# EAGLE design untitled (EAGLE 9.6.2)
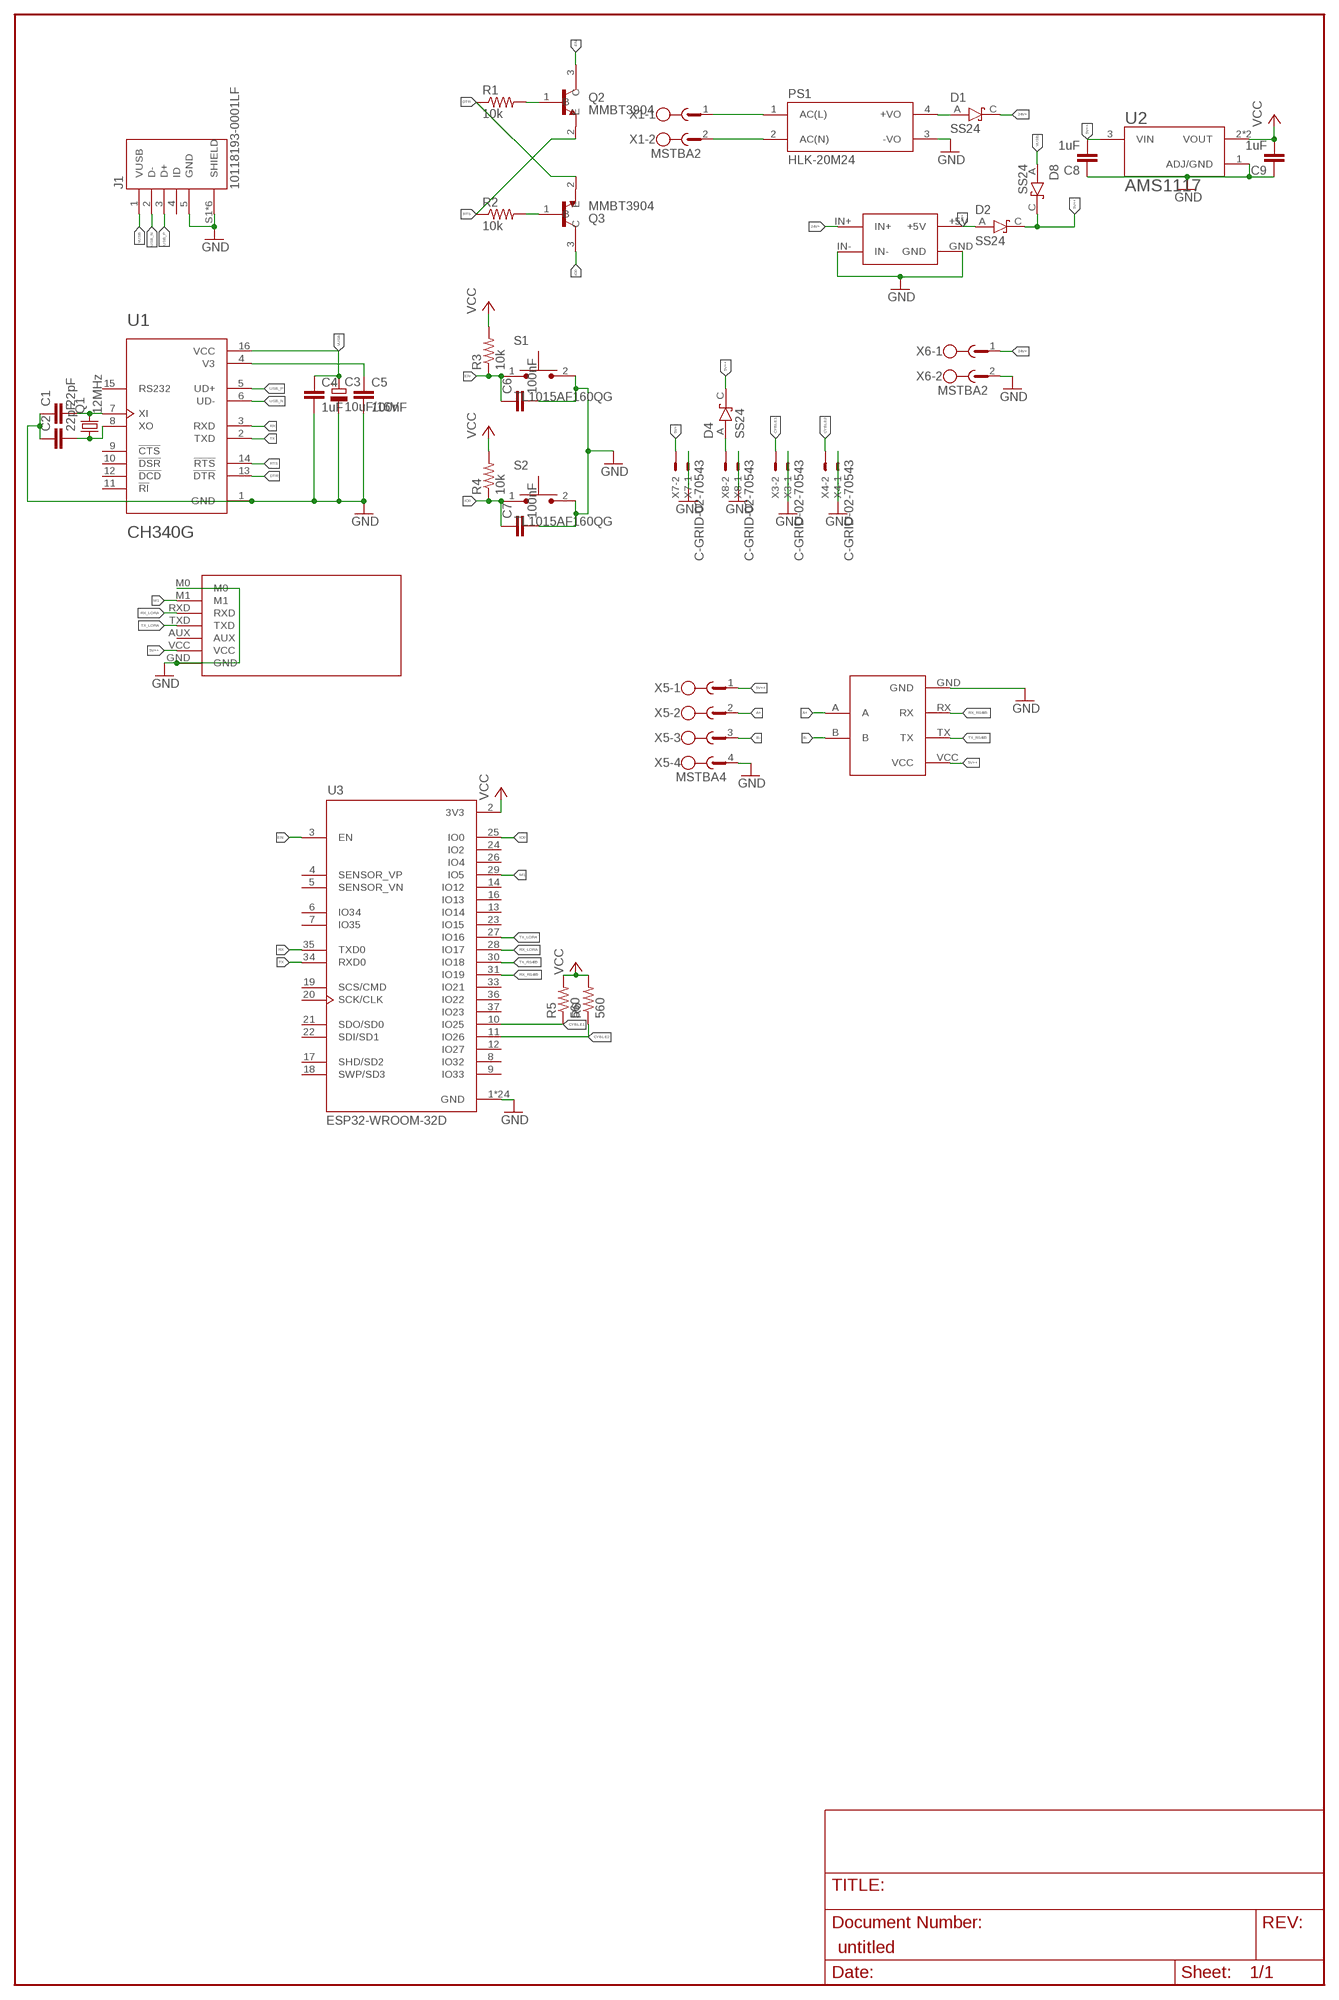
[diagram p0: schematic, sheet 1]

## Parts
C1  22pF  C-EUC0805K  [C0805K]
C2  22pF  C-EUC0805K  [C0805K]
C3  10uF/16V  CPOL-EU153CLV-0505  [153CLV-0505]
C4  1uF  C-EUC0805K  [C0805K]
C5  100nF  C-EUC0805K  [C0805K]
C6  100nF  C-EUC0805K  [C0805K]
C7  100nF  C-EUC0805K  [C0805K]
C8  1uF  C-EUC0805K  [C0805K]
C9  1uF  C-EUC0805K  [C0805K]
D1  SS24  [DIOM5336X265N]
D2  SS24  [DIOM5336X265N]
D4  SS24  [DIOM5336X265N]
D8  SS24  [DIOM5336X265N]
EBYTEE220-900T22D1  EBYTEE220-900T22D  [EBYTEE220-900T22D]
J1  10118193-0001LF  [FCI_10118193-0001LF]
PS1  HLK-20M24  [CONV_HLK-20M24]
Q1  12MHz  CRYSTALSM49  [SM49]
Q2  MMBT3904  [SOT95P240X120-3N]
Q3  MMBT3904  [SOT95P240X120-3N]
R1  10k  R-US_M0805  [M0805]
R2  10k  R-US_M0805  [M0805]
R3  10k  R-US_M0805  [M0805]
R4  10k  R-US_M0805  [M0805]
R5  560  R-US_M0805  [M0805]
R6  560  R-US_M0805  [M0805]
S1  TL1015AF160QG  [SW_TL1015AF160QG]
S2  TL1015AF160QG  [SW_TL1015AF160QG]
SUPER-STEPDOWN1  SUPER-STEPDOWN  [SUPER-STEPDOWN]
TTL-RS1  TTL-RS485  [TTL-RS485]
U1  CH340G  [SOIC127P600X180-16N]
U2  AMS1117  [SOT229P700X180-4N]
U3  ESP32-WROOM-32D  [MODULE_ESP32-WROOM-32D]
X1  MSTBA2  [MSTBA2]
X3  C-GRID-02-70543  [70543-02]
X4  C-GRID-02-70543  [70543-02]
X5  MSTBA4  [MSTBA4]
X6  MSTBA2  [MSTBA2]
X7  C-GRID-02-70543  [70543-02]
X8  C-GRID-02-70543  [70543-02]

## Nets
5V+: D2.A SUPER-STEPDOWN1.+5V X7.2
5V++: C8.2 D2.C(K) D4.C(K) D8.C(K) EBYTEE220-900T22D1.VCC TTL-RS1.VCC U2.3(VIN) X5.1
24V+: D1.C(K) SUPER-STEPDOWN1.IN+ X6.1
A+: TTL-RS1.A X5.2
B-: TTL-RS1.B X5.3
CYBLE1: R5.1 U3.10(IO25) X3.2
CYBLE2: R6.1 U3.11(IO26) X4.2
DTR: Q3.2(E) R1.1 U1.13(!DTR)
EN: C6.1 Q2.3(C) R3.1 S1.1 U3.3(EN)
GND: C1.1 C2.1 C3.- C4.2 C5.2 C6.2 C7.2 C8.1 C9.1 EBYTEE220-900T22D1.GND EBYTEE220-900T22D1.M0 J1.5(GND) J1.S1(SHIELD) J1.S2(SHIELD) J1.S3(SHIELD) J1.S4(SHIELD) J1.S5(SHIELD) J1.S6(SHIELD) PS1.3(-VO) S1.2 S2.2 SUPER-STEPDOWN1.GND SUPER-STEPDOWN1.IN- TTL-RS1.GND U1.1(GND) U2.1(ADJ/GND) U3.1(GND) U3.15(GND) U3.38(GND) U3.39_1(GND) U3.39_2(GND) U3.39_3(GND) U3.39_4(GND) U3.39_5(GND) U3.39_6(GND) U3.39_7(GND) U3.39_8(GND) U3.39_9(GND) U3.39_10(GND) U3.39_11(GND) U3.39_12(GND) U3.39_13(GND) U3.39_14(GND) U3.39_15(GND) U3.39_16(GND) U3.39_17(GND) U3.39_18(GND) U3.39_19(GND) U3.39_20(GND) U3.39_21(GND) X3.1 X4.1 X5.4 X6.2 X7.1 X8.1
IO0: C7.1 Q3.3(C) R4.1 S2.1 U3.25(IO0)
M1: EBYTEE220-900T22D1.M1 U3.29(IO5)
N$1: PS1.1(AC(L)) X1.1
N$2: C5.1 U1.4(V3)
N$3: Q2.1(B) R1.2
N$4: C1.2 Q1.2 U1.7(XI)
N$5: C2.2 Q1.1 U1.8(XO)
N$6: Q3.1(B) R2.2
N$7: PS1.2(AC(N)) X1.2
N$9: D1.A PS1.4(+VO)
N$12: D4.A X8.2
RTS: Q2.2(E) R2.1 U1.14(!RTS)
RX: U1.3(RXD) U3.35(TXD0)
RX_LORA: EBYTEE220-900T22D1.RXD U3.28(IO17)
RX_RS485: TTL-RS1.RX U3.31(IO19)
TX: U1.2(TXD) U3.34(RXD0)
TX_LORA: EBYTEE220-900T22D1.TXD U3.27(IO16)
TX_RS485: TTL-RS1.TX U3.30(IO18)
USB_N: J1.2(D-) U1.6(UD-)
USB_P: J1.3(D+) U1.5(UD+)
VCC: C9.2 R3.2 R4.2 R5.2 R6.2 U2.2(VOUT) U2.4(VOUT) U3.2(3V3)
VUSB: C3.+ C4.1 D8.A J1.1(VUSB) U1.16(VCC)
Unconnected: EBYTEE220-900T22D1.AUX J1.4(ID) U1.9(!CTS) U1.10(!DSR) U1.11(!RI) U1.12(!DCD) U1.15(RS232) U3.4(SENSOR_VP) U3.5(SENSOR_VN) U3.6(IO34) U3.7(IO35) U3.8(IO32) U3.9(IO33) U3.12(IO27) U3.13(IO14) U3.14(IO12) U3.16(IO13) U3.17(SHD/SD2) U3.18(SWP/SD3) U3.19(SCS/CMD) U3.20(SCK/CLK) U3.21(SDO/SD0) U3.22(SDI/SD1) U3.23(IO15) U3.24(IO2) U3.26(IO4) U3.33(IO21) U3.36(IO22) U3.37(IO23)

## Library data of the parts
C1 C2 C4-C9 = rcl:C-EU: CAPACITOR, European symbol; SPICEPREFIX: C
C3 = rcl:CPOL-EU: POLARIZED CAPACITOR, European symbol; SPICEPREFIX: C
D1 D2 D4 D8 = SS24:SS24: Diode Schottky 40V 2A Surface Mount DO-214AA (SMB) Check availability <https://pricing.snapeda.com/parts/SS24/ON%20Semiconductor/view-part?ref=eda>; AVAILABILITY: In Stock; CHECK_PRICES: https://www.snapeda.com/parts/SS24/Onsemi/view-part/?ref=eda; DESCRIPTION: Diode Schottky 40V 2A Surface Mount DO-214AA (SMB); MF: ON Semiconductor; MP: SS24; PACKAGE: DO-214AA ON Semiconductor; PRICE: None; SNAPEDA_LINK: https://www.snapeda.com/parts/SS24/Onsemi/view-part/?ref=snap
EBYTEE220-900T22D1 = EByte E220-900T22D:EBYTEE220-900T22D
J1 = 10118193-0001LF:10118193-0001LF: Micro USB B Type Receptacle Check availability <https://pricing.snapeda.com/parts/10118193-0001LF/FCI/view-part?ref=eda>; AVAILABILITY: In Stock; DESCRIPTION: USB - micro B USB 2.0 Receptacle Connector 5 Position Surface Mount, Right Angle; Through Hole; MF: FCI; MP: 10118193-0001LF; PACKAGE: None; PRICE: None; PURCHASE-URL: https://pricing.snapeda.com/search/part/10118193-0001LF/?ref=eda
PS1 = HLK-20M24:HLK-20M24: Check availability <https://pricing.snapeda.com/parts/HLK-20M24/Hi-link/view-part?ref=eda>; AVAILABILITY: Not in stock; CHECK_PRICES: https://www.snapeda.com/parts/HLK-20M24/Hi-link/view-part/?ref=eda; DESCRIPTION: 20W ultra-small series module power supply; MF: Hi-link; MP: HLK-20M24; PACKAGE: Non-Standard Hi-link; PRICE: None; SNAPEDA_LINK: https://www.snapeda.com/parts/HLK-20M24/Hi-link/view-part/?ref=snap
Q1 = crystal:CRYSTAL: CRYSTAL; OC_FARNELL: unknown; OC_NEWARK: unknown
Q2 Q3 = MMBT3904:MMBT3904: MMBT3904 Series 40 V CE Breakdown 0.2 A NPN General Purpose Amplifier - SOT-23 Check availability <https://pricing.snapeda.com/parts/MMBT3904/ON%20Semiconductor/view-part?ref=eda>; AVAILABILITY: In Stock; DESCRIPTION: Bipolar (BJT) Transistor NPN 40 V 200 mA 300MHz 300 mW Surface Mount SOT-23-3 (TO-236); MF: ON Semiconductor; MP: MMBT3904; PACKAGE: SOT-23-3 Motorola; PRICE: None
R1-R6 = rcl:R-US_: RESISTOR, American symbol; SPICEPREFIX: R
S1 S2 = TL1015AF160QG:TL1015AF160QG: Tactile Switch SPST-NO Top Actuated Surface Mount Check availability <https://pricing.snapeda.com/parts/TL1015AF160QG/E-Switch/view-part?ref=eda>; AVAILABILITY: In Stock; DESCRIPTION: Tactile Switch SPST-NO Top Actuated Surface Mount; MF: E-Switch; MP: TL1015AF160QG; PACKAGE: None; PRICE: None; PURCHASE-URL: https://pricing.snapeda.com/search/part/TL1015AF160QG/?ref=eda
SUPER-STEPDOWN1 = SUPER-STEPDOWN:SUPER-STEPDOWN
TTL-RS1 = TTL-RS485:TTL-RS485
U1 = CH340G:CH340G: Check availability <https://pricing.snapeda.com/parts/Ch340G/WCH/view-part?ref=eda>; AVAILABILITY: Not in stock; DESCRIPTION: USB Interface Integrated Circuit; MF: WCH; MP: Ch340G; PACKAGE: None; PRICE: None
U2 = AMS1117:AMS1117: Sot223/Pkg 1-Amp 5-Volt Low Drop Out Voltage Regulatator Check availability <https://pricing.snapeda.com/parts/AMS1117/Advanced%20Monolithic%20Systems/view-part?ref=eda>; AVAILABILITY: Not in stock; DESCRIPTION: 1A LOW DROPOUT VOLTAGE REGULATOR SOT-223; MF: Advanced Monolithic Systems; MP: AMS1117; PACKAGE: SOT-223 Seeed Technology; PRICE: None
U3 = ESP32-WROOM-32D:ESP32-WROOM-32D: Bluetooth, WiFi 802.11b/g/n, Bluetooth v4.2 + EDR, Class 1, 2 and 3 Transceiver Module 2.4GHz ~ 2.5GHz Integrated, Trace Surface Mount Check availability <https://pricing.snapeda.com/parts/ESP32-WROOM-32D/Espressif%20Systems/view-part?ref=eda>; AVAILABILITY: In Stock; DESCRIPTION: Bluetooth, WiFi 802.11b/g/n, Bluetooth v4.2 +EDR, Class 1, 2 and 3 Transceiver Module 2.4GHz ~ 2.5GHz Integrated; MF: Espressif Systems; MP: ESP32-WROOM-32D; PACKAGE: Module Espressif Systems; PRICE: None; PURCHASE-URL: https://pricing.snapeda.com/search/part/ESP32-WROOM-32D/?ref=eda
X1 X6 = con-phoenix-508:MSTBA2: PHOENIX; MF: FARNELL; MPN: 1757242; OC_FARNELL: 3705171; OC_NEWARK: 71C4161
X3 X4 X7 X8 = con-molex:C-GRID-02: CONNECTOR wire to board 2.54 mm (0.100") pitch header; MF: MOLEX; OC_FARNELL: unknown; OC_NEWARK: unknown
X5 = con-phoenix-508:MSTBA4: PHOENIX; MF: FARNELL; MPN: 1757268; OC_FARNELL: 3705195; OC_NEWARK: 71C4163

## Board
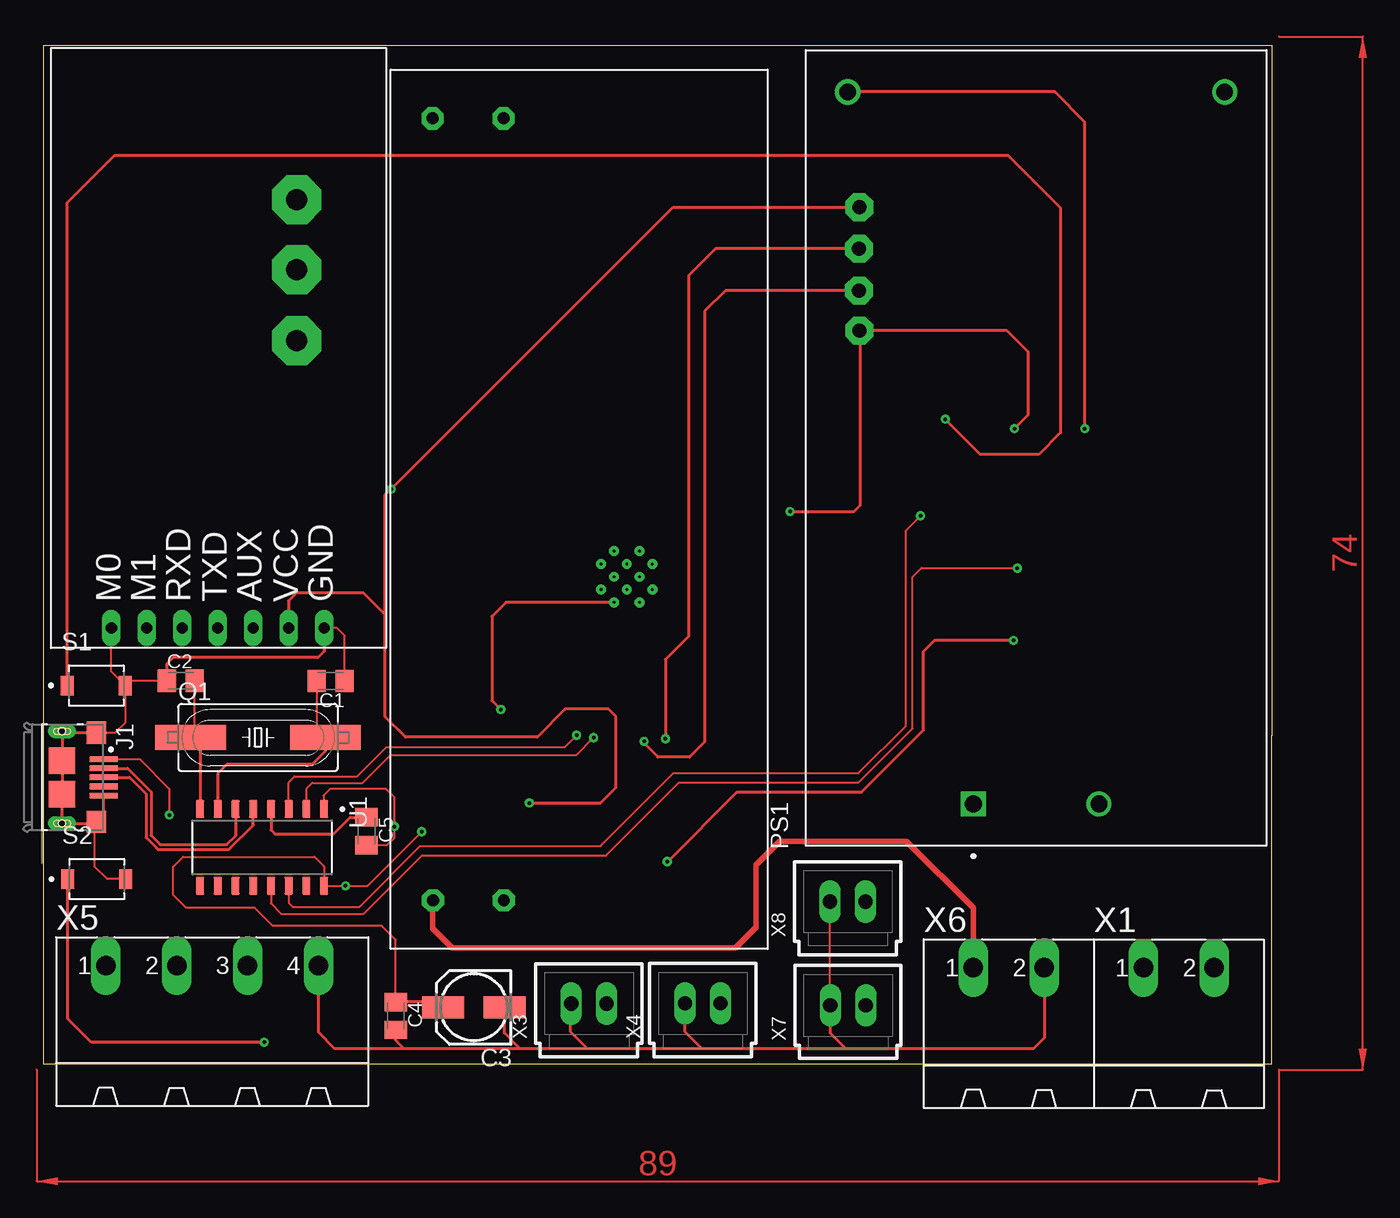
[diagram p1: board, top side]
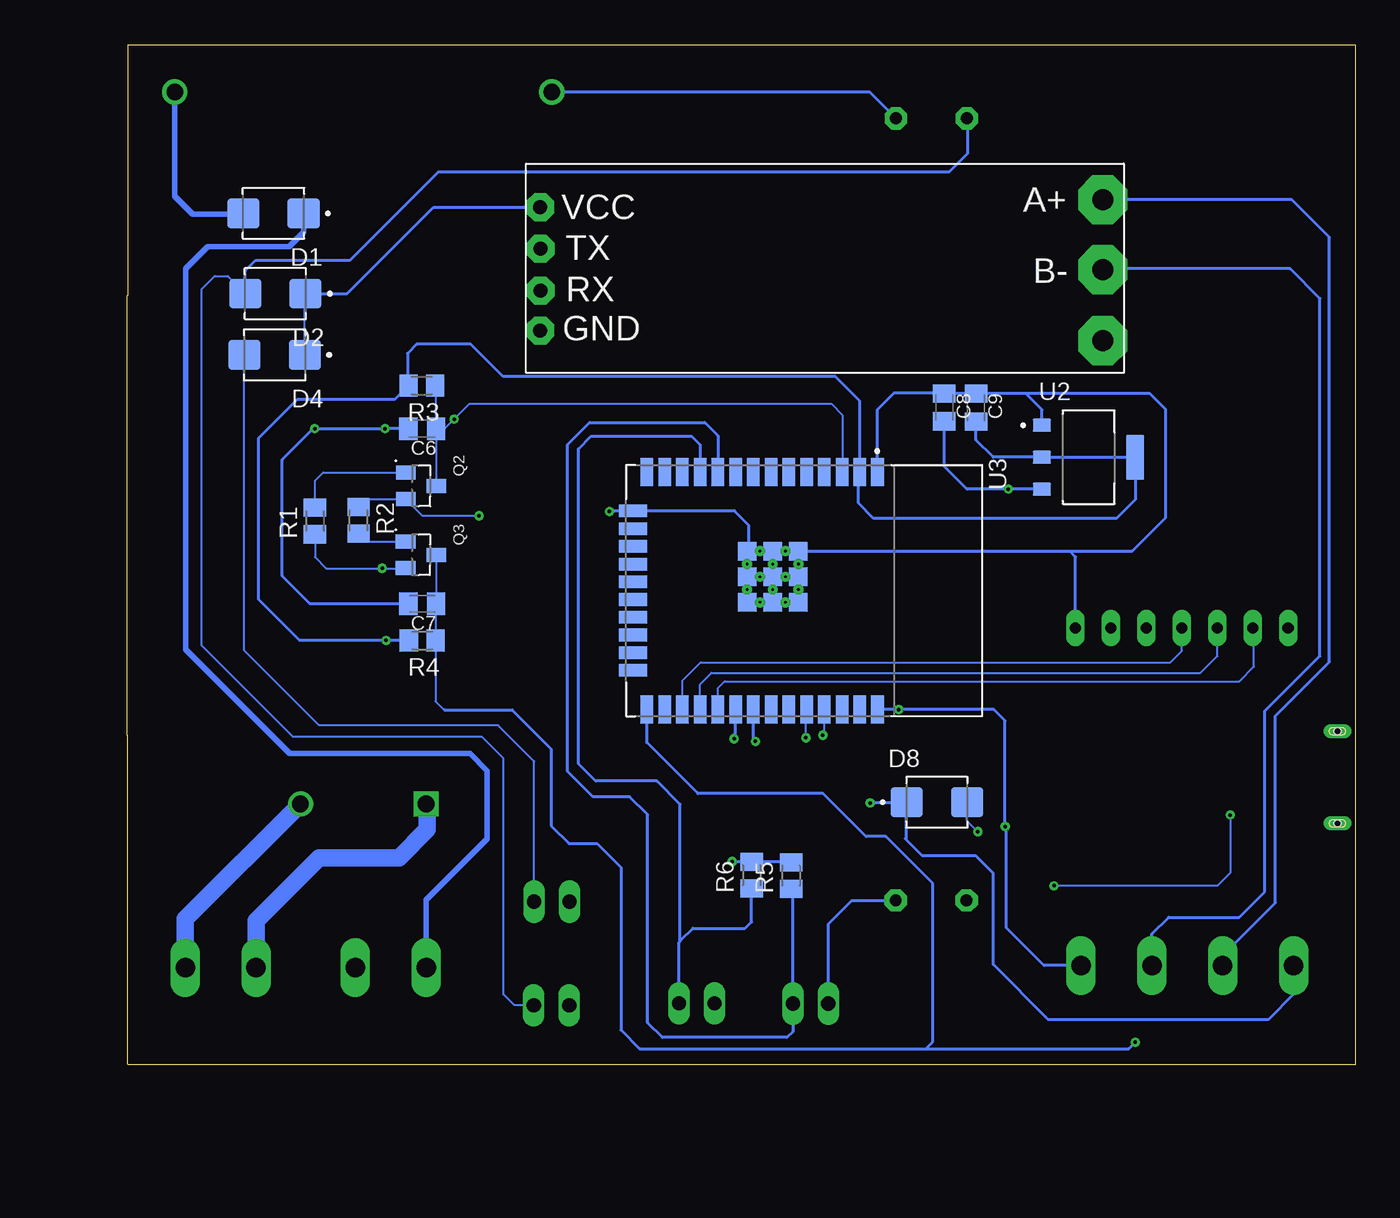
[diagram p2: board, bottom side, seen from below]

Size 88.01 x 73 mm. Coordinates in mm from the lower left corner, seen from the top.
Outline: 0,73 88,73 88,55.07 88.01,55.07 88.01,23.57 88,23.57 88,0 0,0 0,73
Copper layers (1*16): Top 0.035mm / dielectric 1.5mm / Bottom 0.035mm
Design rules "default *": minimum track width 6mil, minimum drill 0.25mm, track to track 6mil, track to pad 6mil, pad to pad 6mil, via to via 6mil, smd to smd 6mil, copper to edge 40mil, drill to drill 6mil, minimum pad ring 10mil, minimum via ring 8mil, stop-mask expansion 4mil, vias tented up to drill 0mil, thermal gap 10mil

### Footprints (pad centres in the part's own frame; a part is rotated, then mirrored left to right if it is on the bottom)
C0805K = smd 1.3 x 1.6: 1 -1,0; 2 1,0
153CLV-0505 = smd 3 x 1.6: + 2.2,0; - -2.2,0
DIOM5336X265N = smd 2.29 x 2.12: A 2.16,0; C -2.16,0
EBYTEE220-900T22D = drill 0.8 pad 1.27 long: AUX -4.56,-10.98; GND -4.56,-16.06; M0 -4.56,-0.82; M1 -4.56,-3.36; RXD -4.56,-5.9; TXD -4.56,-8.44; VCC -4.56,-13.52
FCI_10118193-0001LF = smd 0.4 x 2: 1 -1.3,2.975; 2 -0.65,2.975; 3 0,2.975; 4 0.65,2.975; 5 1.3,2.975 | smd 1.6 x 1.4: S1 -3.2,2.45; S2 3.2,2.45 | smd 1.9 x 1.9: S3 1.2,0; S4 -1.2,0 | drill 0.5 pad 0.9 long: S5 -3.3,0; S6 3.3,0 | hole 0.5: -3.3,0; 3.3,0
CONV_HLK-20M24 = drill 1.2 square: 1 -25.5,4.5 | drill 1.2: 2 -25.5,-4.5; 3 25.5,13.5; 4 25.5,-13.5
SM49 = smd 5.08 x 1.778: 1 -4.826,0; 2 4.826,0
SOT95P240X120-3N = smd 1 x 1.4: 1 -0.95,-1.1; 2 0.95,-1.1; 3 0,1.1
M0805 = smd 1.3 x 1.6: 1 -0.95,0; 2 0.95,0
SW_TL1015AF160QG = smd 0.95 x 1.4: 1 -2.075,0; 2 2.075,0
SUPER-STEPDOWN = drill 0.85 pad 1.6 octagon: +5V 59.509,24.006; GND 59.509,18.926; IN+ 3.478,23.979; IN- 3.478,18.899
TTL-RS485 = drill 1.5 pad 3.5 octagon: A -19.7,-6; B -19.7,-1; P$7 -19.7,4.1 | drill 1 pad 2 octagon: GND 20.6,3.37; RX 20.581,0.505; TX 20.583,-2.493; VCC 20.6,-5.47
SOIC127P600X180-16N = smd 1.31 x 0.62: 1 -2.75,4.445; 2 -2.75,3.175; 3 -2.75,1.905; 4 -2.75,0.635; 5 -2.75,-0.635; 6 -2.75,-1.905; 7 -2.75,-3.175; 8 -2.75,-4.445; 9 2.75,-4.445; 10 2.75,-3.175; 11 2.75,-1.905; 12 2.75,-0.635; 13 2.75,0.635; 14 2.75,1.905; 15 2.75,3.175; 16 2.75,4.445
SOT229P700X180-4N = smd 1.31 x 0.93: 1 -3.345,2.29; 2 -3.345,0; 3 -3.345,-2.29 | smd 1.31 x 3.24: 4 3.345,0
MODULE_ESP32-WROOM-32D = smd 2 x 0.9: 1 -8.5,5.26; 2 -8.5,3.99; 3 -8.5,2.72; 4 -8.5,1.45; 5 -8.5,0.18; 6 -8.5,-1.09; 7 -8.5,-2.36; 8 -8.5,-3.63; 9 -8.5,-4.9; 10 -8.5,-6.17; 11 -8.5,-7.44; 12 -8.5,-8.71; 13 -8.5,-9.98; 14 -8.5,-11.25; 25 8.5,-11.25; 26 8.5,-9.98; 27 8.5,-8.71; 28 8.5,-7.44; 29 8.5,-6.17; 30 8.5,-4.9; 31 8.5,-3.63; 32 8.5,-2.36; 33 8.5,-1.09; 34 8.5,0.18; 35 8.5,1.45; 36 8.5,2.72; 37 8.5,3.99; 38 8.5,5.26 | smd 0.9 x 2: 15 -5.715,-12.25; 16 -4.445,-12.25; 17 -3.175,-12.25; 18 -1.905,-12.25; 19 -0.635,-12.25; 20 0.635,-12.25; 21 1.905,-12.25; 22 3.175,-12.25; 23 4.445,-12.25; 24 5.715,-12.25 | smd 1.33 x 1.33: 39_1 -2.835,-0.405; 39_2 -1,-0.405; 39_3 0.835,-0.405; 39_4 -2.835,-2.24; 39_5 -1,-2.24; 39_6 0.835,-2.24; 39_7 -2.835,-4.075; 39_8 -1,-4.075; 39_9 0.835,-4.075 | drill 0.2 pad 0.3: 39_10 -1.917,-0.405; 39_11 -0.083,-0.405; 39_12 -2.835,-1.323; 39_13 -1,-1.323; 39_14 0.835,-1.323; 39_15 -1.917,-2.24; 39_16 -0.083,-2.24; 39_17 -2.835,-3.158; 39_18 -1,-3.158; 39_19 0.835,-3.158; 39_20 -1.917,-4.075; 39_21 -0.083,-4.075
MSTBA2 = drill 1.397 long: 1 -2.54,5.08; 2 2.54,5.08
70543-02 = drill 1.016 long: 1 -1.27,0; 2 1.27,0
MSTBA4 = drill 1.397 long: 1 -7.62,5.08; 2 -2.54,5.08; 3 2.54,5.08; 4 7.62,5.08

### Placement (x,y rotation side)
C1  20.56,27.45 180 top
C2  9.83,27.48 0 top
C3  30.81,4.07 180 top
C4  25.22,3.45 270 top
C5  23.13,16.7 270 top
C6  66.88,45.53 180 bottom
C7  66.88,32.99 180 bottom
C8  29.48,47.06 270 bottom
C9  27.21,47.05 270 bottom
D1  77.54,60.96 180 bottom
D2  77.4,55.21 180 bottom
D4  77.45,50.82 180 bottom
D8  30.01,18.77 0 bottom
EBYTEE220-900T22D1  4.03,35.81 90 top
J1  1.32,20.55 270 top
PS1  71.11,44.16 90 top
Q1  15.36,23.41 0 top
Q2  66.97,41.43 270 bottom
Q3  66.97,36.49 270 bottom
R1  74.56,38.92 90 bottom
R2  71.44,38.97 270 bottom
R3  66.9,48.62 180 bottom
R4  66.89,30.36 180 bottom
R5  40.46,13.51 90 bottom
R6  43.29,13.54 90 bottom
S1  3.77,27.13 0 top
S2  3.81,13.27 0 top
SUPER-STEPDOWN1  51.87,8.26 90 top
TTL-RS1  37.83,55.93 180 bottom
U1  15.65,15.53 270 top
U2  19.14,43.49 0 bottom
U3  39.53,33.93 270 bottom
X1  81.32,1.83 0 top
X3  39.06,4.35 0 top
X4  47.21,4.36 0 top
X5  12.07,1.99 0 top
X6  69.14,1.84 0 top
X7  57.62,4.23 0 top
X8  57.6,11.65 0 top

### Tracks (layer width: path | path; a pad name or v marks a point on that pad's centre or on a via)
5V+
  Bottom 0.152: X7.2 60.28,4.23 61.06,5.01 61.06,21.91 62.6,23.45 76.14,23.45 82.67,29.98 82.67,55.55 81.75,56.47 80.82,56.47 D2.A
  Bottom 0.203: D2.A 79.56,56.84 78.8,57.6 72.06,57.6 65.71,63.94 29.13,63.94 27.81,65.26 27.81,67.71 SUPER-STEPDOWN1.+5V
5V++  (via drill 0.25)
  Top 0.203: v34.79,18.72 39.89,18.72 40.99,19.82 40.99,24.91 40.47,25.44 37.36,25.44 35.37,23.45 25.91,23.45 24.46,24.89 24.46,32.21 | 24.46,32.21 22.93,33.74 18.08,33.74 17.54,33.2 17.54,31.27 EBYTEE220-900T22D1.VCC | 24.46,32.21 24.46,40.8 24.9,41.25 v24.9,41.2 45.1,61.4 TTL-RS1.VCC
  Bottom 0.152: D4.C 75.29,55.16 D2.C
  Bottom 0.203: D2.C 72.25,55.21 66.06,61.4 TTL-RS1.VCC | U2.3 v24.9,41.2 27.85,41.2 29.48,42.83 C8.2 | X5.1 4.45,5.03 6.29,3.19 22.02,3.19 25.97,7.14 25.97,13.68 27.23,14.94 31.06,14.94 32.24,16.12 | 32.24,16.12 32.3,16.17 | 32.3,18.64 D8.C | D8.C 32.24,18.7 32.24,16.12 | D8.C 32.22,18.72 v34.79,18.72
24V+
  Top 0.406: X6.1 66.6,11.19 61.82,15.96 52.71,15.96 51.03,14.28 51.03,9.82 49.56,8.34 29.25,8.34 27.85,9.75 27.85,11.7 SUPER-STEPDOWN1.IN+
  Bottom 0.406: X6.1 66.6,11.77 62.23,16.13 62.23,21.02 63.46,22.25 76.39,22.25 83.85,29.71 83.85,57.01 82.27,58.58 76.4,58.58 75.38,59.61 D1.C
A+
  Bottom 0.203: X5.2 9.53,7.79 5.76,11.57 5.76,24.95 1.89,28.82 1.89,59.24 4.58,61.94 TTL-RS1.A
B-
  Bottom 0.203: X5.3 14.61,9.32 13.4,10.54 8.35,10.54 6.53,12.36 6.53,25.29 2.58,29.24 2.58,54.86 4.71,56.99 18.08,56.99 TTL-RS1.B
CYBLE1
  Bottom 0.203: R5.1 40.33,12.44 X3.2 40.33,2.34 40.76,1.91 49.67,1.91 50.73,2.97 50.73,17.89 52.02,19.17 54.66,19.17 56.47,20.97 56.47,44.39 54.88,45.98 46.64,45.98 45.7,45.03 U3.10
CYBLE2
  Bottom 0.203: X4.2 48.48,8.75 48.41,8.82 | 48.41,8.82 47.49,9.73 43.75,9.73 43.29,10.2 R6.1 | 48.41,8.82 48.41,18.62 50.08,20.29 54.45,20.29 55.69,21.52 55.69,44.08 54.77,45 47.58,45 46.97,44.39 U3.11
DTR  (via drill 0.25)
  Top 0.152: U1.13 16.28,11.51 17.01,10.79 22.93,10.79 27.09,14.96 40.3,14.96 45.52,20.18 58.36,20.18 62.24,24.05 62.24,34.91 62.88,35.55 69.75,35.55 v69.75,35.53
  Bottom 0.152: R1.1 74.56,36.33 73.76,35.53 v69.75,35.53 Q3.2
EN  (via drill 0.25)
  Top 0.203: S1.1 1.69,61.73 5.07,65.11 69.08,65.11 72.84,61.36 72.84,45.24 71.28,43.69 67.1,43.69 v64.58,46.2 | v64.58,46.2 | v64.58,46.2 v64.59,46.21
  Bottom 0.152: Q2.3 65.87,45.52 C6.1 | C6.1 65.88,48.55 R3.1 | C6.1 65.27,45.53 v64.59,46.21 63.49,47.31 37.58,47.31 36.79,46.52 36.79,42.45 U3.3
GND  (via drill 0.25)
  Top 0.152: X7.1 56.32,4.25 X8.1 | S2.2 4.55,13.27 3.67,14.15 3.67,17.25 | C5.2 24.6,15.7 25.13,16.23 v25.13,17.03 25.13,19.11 24.52,19.72 20.51,19.72 20.05,19.26 20.05,18.32 U1.1 | S1.2 4.85,28.12 EBYTEE220-900T22D1.M0 | S1.2 6.19,27.48 C2.1 | C1.1 21.56,30.7 21.01,31.25 EBYTEE220-900T22D1.GND | J1.S1 5.14,23.75 5.86,24.48 5.86,27.11 S1.2
  Top 0.203: X6.2 71.68,1.88 70.92,1.12 57.46,1.12 | X7.1 56.35,2.23 57.46,1.12 | 57.46,1.12 47.16,1.12 | X4.1 45.94,2.34 47.16,1.12 | 47.16,1.12 38.95,1.12 | 38.95,1.12 37.74,2.33 37.74,4.29 X3.1 | 38.95,1.12 34.13,1.12 | C3.- 33.01,2.23 34.13,1.12 | J1.5 4.3,17.88 J1.S2 3.67,17.25 J1.S6 J1.S3 J1.S4 J1.S5 1.42,23.75 J1.S1 | 34.13,1.12 25.82,1.12 | C4.2 25.22,1.72 25.82,1.12 | 25.82,1.12 20.86,1.12 19.69,2.29 X5.4 | U3.39_14 33.12,33.09 32.11,32.08 32.11,26.04 v32.75,25.4 | EBYTEE220-900T22D1.GND 20.09,29.57 19.65,29.13 9.27,29.13 8.83,28.69 C2.1 | v69.55,45.53 70.54,46.53 70.54,51.03 69,52.57 58.5,52.57 | 58.5,52.57 58.44,52.57 TTL-RS1.GND | v53.47,39.6 58.05,39.6 58.5,40.05 58.5,52.57 | v74.59,45.53 74.59,67.5 72.43,69.66 PS1.3
  Bottom 0.203: C7.2 74.92,32.99 76.91,34.98 76.91,43.31 74.68,45.53 v74.59,45.53 v69.55,45.53 C6.2 | PS1.3 34.83,69.66 SUPER-STEPDOWN1.GND | 43.61,34.95 U3.39_20 43.61,36.6 | 43.61,34.95 U3.39_8 U3.39_21 U3.39_9 U3.39_19 U3.39_6 | 43.61,36.6 U3.39_7 43.49,36.88 43.49,38.62 44.51,39.64 U3.15 53.43,39.64 v53.47,39.6 | 43.61,36.6 43.45,36.76 U3.39_17 41.83,36.76 | 41.83,36.76 U3.39_4 U3.39_12 40.06,36.76 | 43.61,34.95 42.71,34.95 U3.39_18 41.86,34.93 | 41.86,34.93 U3.39_5 41.77,34.94 | U3.39_6 U3.39_16 41.77,34.84 41.86,34.93 | 41.77,34.94 U3.39_15 41.77,36.7 41.83,36.76 | 40.06,36.76 U3.39_1 20.5,36.76 | 40.06,36.76 39.94,36.64 U3.39_10 U3.39_2 | U3.39_2 U3.39_13 40.87,34.94 41.77,34.94 | U3.39_2 U3.39_11 U3.39_3 U3.39_14 U3.39_6 | U2.1 22.49,46.89 23.65,48.05 | 23.65,48.05 C9.1 27.22,48.06 C8.1 29.54,48.11 33.06,48.11 34.27,46.9 U3.1 | 20.5,36.76 16.02,36.76 13.62,39.16 13.62,46.91 14.76,48.05 23.65,48.05 | EBYTEE220-900T22D1.GND 20.09,36.35 20.5,36.76 | U3.38 34.25,25.4 v32.75,25.4 25.91,25.4 25.13,24.62 v25.13,17.03 25.04,17.03 25.04,9.77 22.34,7.07 X5.4 | X3.1 37.79,10.04 36.1,11.73 SUPER-STEPDOWN1.IN-
IO0  (via drill 0.25)
  Top 0.203: v15.81,1.58 3.42,1.58 1.73,3.27 S2.1
  Bottom 0.152: Q3.3 C7.1 65.94,32.93 R4.1 65.94,26.01 65.32,25.39 | 50.82,25.39 U3.25
  Bottom 0.203: 65.32,25.39 60.45,25.39 57.64,22.58 57.64,17.08 56.37,15.81 54.35,15.81 52.64,14.11 52.64,2.46 51.3,1.12 30.8,1.12 | 30.8,1.12 30.3,1.61 30.3,12.95 33.67,16.32 35.08,16.32 38.16,19.39 47.14,19.39 50.78,23.04 U3.25 | 30.8,1.12 16.27,1.12 v15.81,1.58
M1
  Bottom 0.152: U3.29 45.7,26.95 45.22,27.43 8.36,27.43 7.3,28.49 7.3,31.17 EBYTEE220-900T22D1.M1
N$1
  Bottom 1.27: X1.1 78.78,10.29 74.27,14.8 68.55,14.8 66.54,16.81 66.54,18.59 PS1.1
N$2
  Top 0.203: C5.1 21.97,17.7 20.77,16.5 16.57,16.5 16.28,16.78 U1.4
N$3
  Bottom 0.152: R1.2 74.56,41.81 73.97,42.4 68.08,42.4 Q2.1
N$4
  Top 0.152: C1.2 19.56,24.03 Q1.2
  Top 0.203: Q1.2 20.18,22.42 19.23,21.46 13.12,21.46 12.47,20.82 U1.7
N$5
  Top 0.152: Q1.1 10.83,23.71 C2.2
  Top 0.203: Q1.1 11.2,22.74 U1.8
N$6
  Bottom 0.152: R2.2 70.85,37.44 Q3.1
N$7
  Bottom 1.27: X1.2 83.86,10.4 PS1.2
N$9
  Bottom 0.406: PS1.4 84.61,62.18 83.32,60.9 79.76,60.9 D1.A
N$12
  Bottom 0.152: X8.2 58.86,21.7 61.44,24.28 74.28,24.28 79.66,29.66 79.66,50.78 D4.A
RTS  (via drill 0.25)
  Top 0.152: U1.14 17.55,11.55 17.83,11.27 22.62,11.27 26.98,15.63 39.9,15.63 45.13,20.86 58.39,20.86 61.76,24.24 61.76,38.23 v62.82,39.29
  Bottom 0.152: R2.1 70.88,40.48 Q2.2 66.87,39.29 v62.82,39.29
RX  (via drill 0.25)
  Top 0.152: U1.3 17.55,20.2 17.97,20.62 22.46,20.62 24.57,22.73 37.34,22.73 v38.18,23.57
  Bottom 0.152: v38.18,23.57 38.08,23.67 U3.35
RX_LORA
  Bottom 0.152: U3.28 46.97,27.22 46.16,28.04 11.12,28.04 9.92,29.24 9.92,31.24 EBYTEE220-900T22D1.RXD
RX_RS485  (via drill 0.25)
  Top 0.203: TTL-RS1.RX 48.85,55.43 47.36,53.94 47.36,23.09 46.28,22.01 44.01,22.01 43.02,23 v43.02,23.13
  Bottom 0.203: v43.02,23.13 43.16,23.27 U3.31
TX  (via drill 0.25)
  Top 0.152: U1.2 18.82,19.74 19.25,20.17 22.86,20.17 24.85,22.15 38.16,22.15 v39.4,23.39
  Bottom 0.152: v39.4,23.39 39.4,25.38 U3.34
TX_LORA
  Bottom 0.152: U3.27 48.24,27.49 46.94,28.79 13.29,28.79 12.46,29.62 12.46,31.24 EBYTEE220-900T22D1.TXD
TX_RS485  (via drill 0.25)
  Top 0.203: TTL-RS1.TX 48.11,58.42 46.2,56.51 46.2,30.65 44.54,29 v44.54,23.33
  Bottom 0.203: v44.54,23.33 44.43,23.44 U3.30
USB_N
  Top 0.203: J1.2 6,21.2 7.69,19.52 7.69,16.39 8.35,15.73 13.12,15.73 13.76,16.37 13.74,16.39 U1.6
USB_P
  Top 0.203: J1.3 6.15,20.55 7.33,19.37 7.33,16.24 8.09,15.48 | 8.09,15.48 | 8.09,15.48 8.2,15.38 13.26,15.38 13.37,15.48 | 13.37,15.48 | U1.5 15.01,17.12 13.37,15.48
VCC  (via drill 0.25)
  Top 0.203: v44.68,14.51 49.67,19.5 58.6,19.5 63.03,23.93 63.03,29.57 63.84,30.38 69.48,30.38 v69.48,30.36
  Bottom 0.203: R4.2 v69.48,30.36 75.67,30.36 78.6,33.29 78.6,44.86 75.82,47.64 68.84,47.64 67.94,48.54 | 67.94,48.54 R3.2 | C9.2 27.21,44.73 25.97,43.49 U2.2 U2.4 15.8,40.45 17.14,39.11 34.54,39.11 35.65,40.22 35.65,42.32 U3.2 35.54,47.52 37.29,49.27 61.08,49.27 63.4,51.59 67.27,51.59 67.94,50.92 67.94,48.54 | R5.2 40.49,14.49 R6.2 44.66,14.49 v44.68,14.51
VUSB  (via drill 0.25)
  Top 0.152: C4.1 25.22,8.92 24.22,9.93 16.4,9.93 15.12,11.21 10.2,11.21 9.27,12.14 9.27,14.13 9.99,14.86 19.4,14.86 20.09,14.16 U1.16 v21.63,12.78 23.21,12.78 v27.08,16.66 | J1.1 6.88,21.85 9,19.73 v9,17.86
  Top 0.203: C3.+ 28.23,4.46 C4.1
  Bottom 0.152: v27.08,16.66 27.85,17.43 D8.A | v9,17.86 9,13.7 9.92,12.78 v21.63,12.78
(copper drawn outside any net)
  shapes: Top area x2